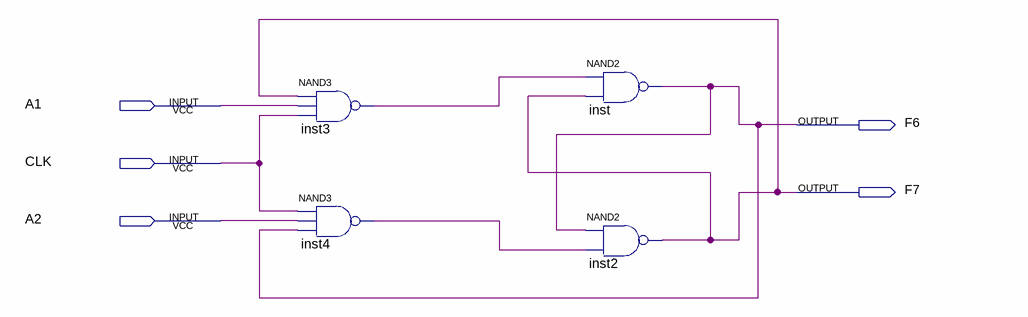
[diagram p0: schematic sheet]
// Quartus schematic jkflipflop.bdf as structural Verilog: 4 symbols, 5 pins
module jkflipflop (
  input  A1,
  input  CLK,
  input  A2,
  output F6,
  output F7
);

  wire inst3_out, inst4_out;

  nand inst3 (inst3_out, F7, A1, CLK);
  nand inst4 (inst4_out, CLK, A2, F6);
  nand inst (F6, inst3_out, F7);
  nand inst2 (F7, F6, inst4_out);
endmodule
